# EAGLE design Connector (EAGLE 7.1.0)
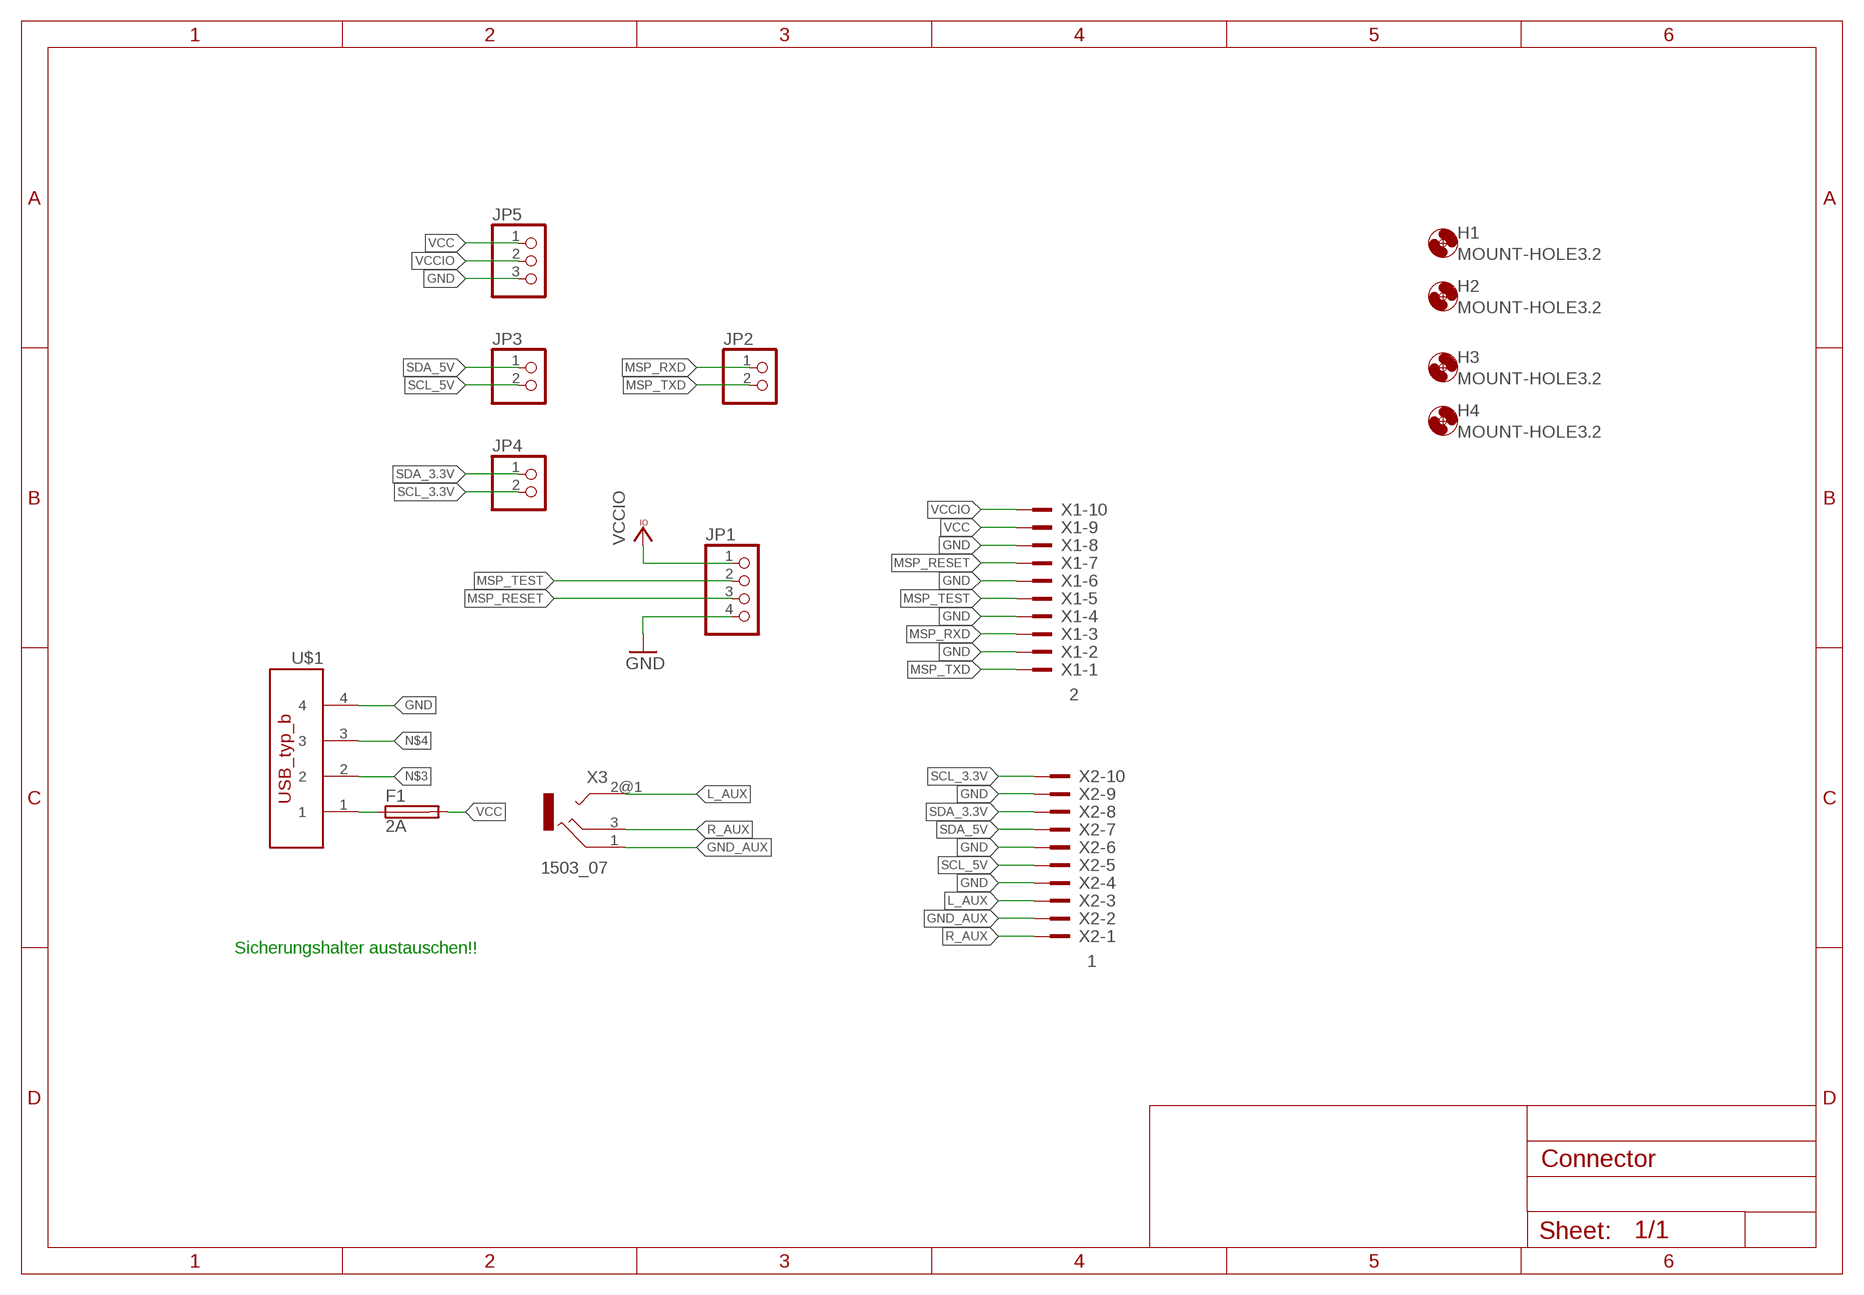
[diagram p0: schematic, sheet 1]

## Parts
F1  2A  SH22,5A  [SH22,5A]
H1  MOUNT-HOLE3.2  [3,2]
H2  MOUNT-HOLE3.2  [3,2]
H3  MOUNT-HOLE3.2  [3,2]
H4  MOUNT-HOLE3.2  [3,2]
JP1  PINHD-1X4  [1X04]
JP2  PINHD-1X2  [1X02]
JP3  PINHD-1X2  [1X02]
JP4  PINHD-1X2  [1X02]
JP5  PINHD-1X3  [1X03]
U$1  USB_TYP_B  [USB_TYP_B]
X1  2  2510-  [PAK100/2500-10]
X2  1  2510-  [PAK100/2500-10]
X3  1503_07  [1503_07]

## Nets
GND: JP1.4 JP5.3 U$1.4 X1.2 X1.4 X1.6 X1.8 X2.4 X2.6 X2.9
GND_AUX: X2.2 X3.1
L_AUX: X2.3 X3.2@1
MSP_RESET: JP1.3 X1.7
MSP_RXD: JP2.1 X1.3
MSP_TEST: JP1.2 X1.5
MSP_TXD: JP2.2 X1.1
N$1: F1.1 U$1.1
N$3: U$1.2
N$4: U$1.3
R_AUX: X2.1 X3.3
SCL_3.3V: JP4.2 X2.10
SCL_5V: JP3.2 X2.5
SDA_3.3V: JP4.1 X2.8
SDA_5V: JP3.1 X2.7
VCC: F1.2 JP5.1 X1.9
VCCIO: JP1.1 JP5.2 X1.10
Unconnected: X3.2@2

## Notes on the sheet
- Sicherungshalter austauschen!!

## Library data of the parts
F1 = fuse:SH22,5A: FUSE HOLDER grid 22,5mm, isolated cap OGN0031 8201, Schurter (Buerklin); MPN: 0031.7701.11; OC_FARNELL: unknown; OC_NEWARK: 04F1224
H1-H4 = holes:MOUNT-HOLE: MOUNTING HOLE with drill center marker
JP1 = pinhead:PINHD-1X4: PIN HEADER
JP2-JP4 = pinhead:PINHD-1X2: PIN HEADER
JP5 = pinhead:PINHD-1X3: PIN HEADER
U$1 = USB_typ_b:USB_TYP_B
X1 X2 = con-3m:2510-: 3M (TM) Pak 100 4-Wall Header Source: 3M; MF: 3M; MPN: 2510-6002UB; OC_FARNELL: 9838244; OC_NEWARK: 46F4725
X3 = con-lumberg:1503_?: Jack connectors according to JISC 6560, 3.5 mm Klinkensteckverbinder nach JISC 6560, 3,5 mm Source: http://www.lumberg.com/Produkte/PDFs/1503_08.pdf; OC_FARNELL: unknown; OC_NEWARK: unknown

## Board
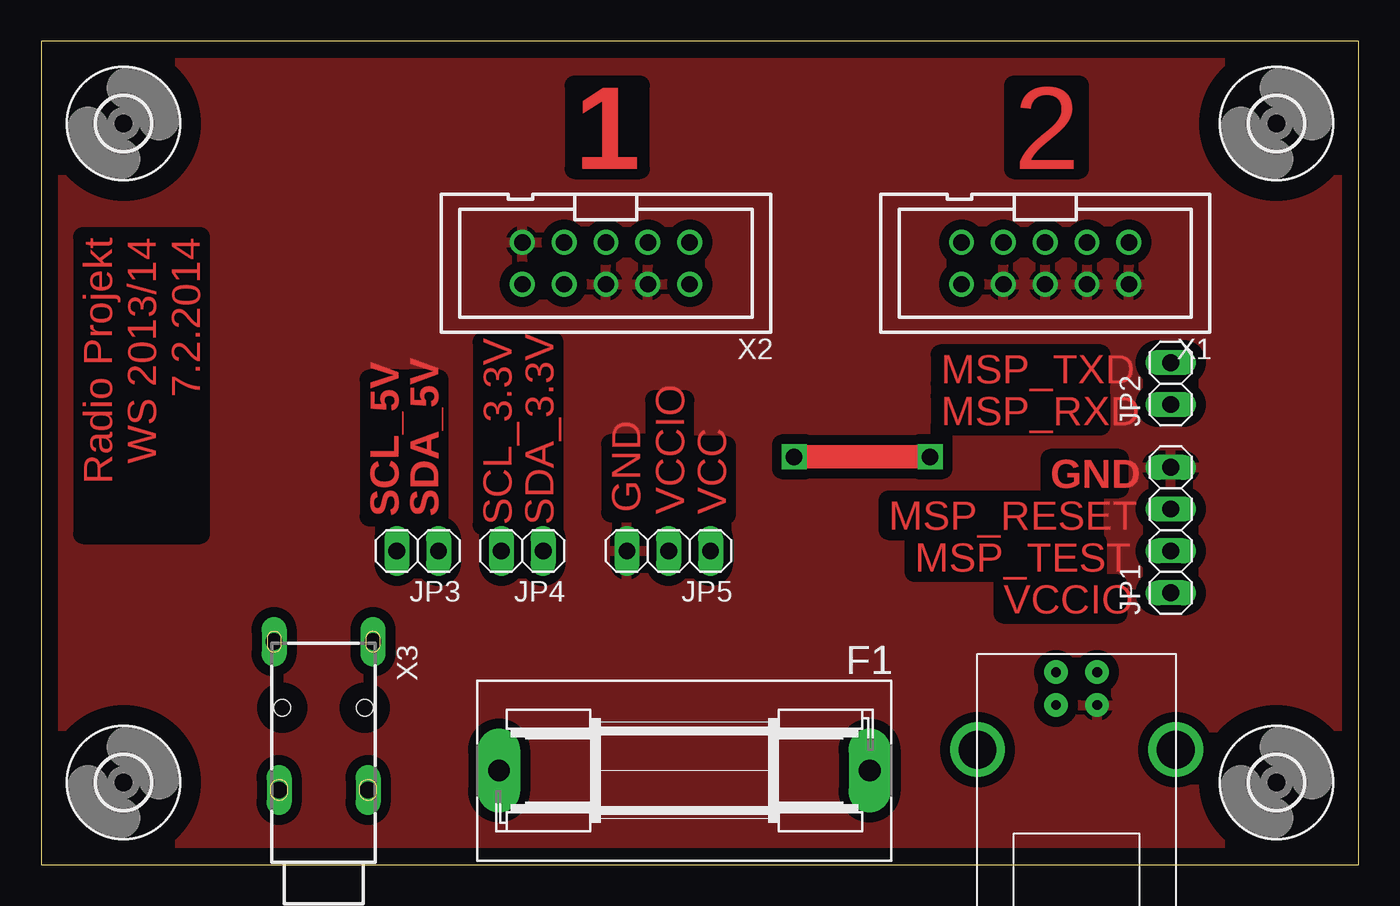
[diagram p1: board, top side]
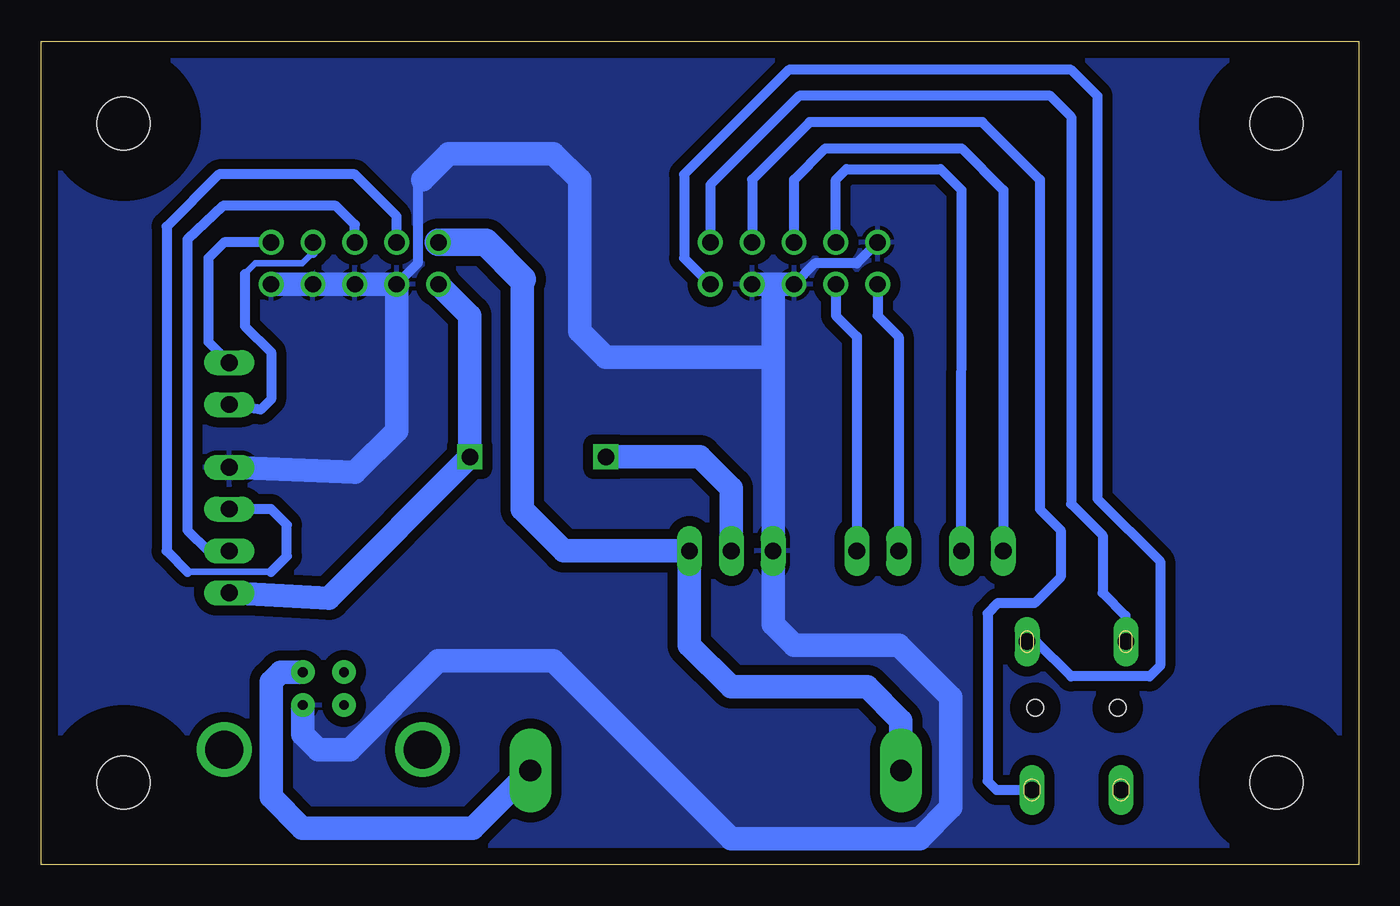
[diagram p2: board, bottom side, seen from below]

Size 80 x 50 mm. Coordinates in mm from the lower left corner, seen from the top.
Outline: 0,0 80,0 80,50 0,50 0,0
Copper layers (1*16): Top 0.035mm / dielectric 1.5mm / Bottom 0.035mm
Design rules "default": minimum track width 10mil, minimum drill 24mil, track to track 8mil, track to pad 8mil, pad to pad 8mil, via to via 8mil, smd to smd 8mil, copper to edge 40mil, drill to drill 8mil, minimum pad ring 10mil, minimum via ring 8mil, stop-mask expansion 4mil, vias tented up to drill 0mil, thermal gap 10mil

### Footprints (pad centres in the part's own frame; a part is rotated, then mirrored left to right if it is on the bottom)
SH22,5A = drill 1.321 pad 2.54 long: 1 -11.252,0; 2 11.252,0
3,2 = hole 3.2: 0,0
1X04 = drill 1.016 long: 1 -3.81,0; 2 -1.27,0; 3 1.27,0; 4 3.81,0
1X02 = drill 1.016 long: 1 -1.27,0; 2 1.27,0
1X03 = drill 1.016 long: 1 -2.54,0; 2 0,0; 3 2.54,0
USB_TYP_B = drill 0.6 pad 1.422: 1 4.71,-1.25; 2 4.71,1.25; 3 2.71,1.25; 4 2.71,-1.25 | drill 2.3: P$1 0,6.02; P$2 0,-6.02
PAK100/2500-10 = drill 1 pad 1.422: 1 -5.08,-1.27; 2 -5.08,1.27; 3 -2.54,-1.27; 4 -2.54,1.27; 5 0,-1.27; 6 0,1.27; 7 2.54,-1.27; 8 2.54,1.27; 9 5.08,-1.27; 10 5.08,1.27
1503_07 = drill 1 pad 1.2 long: 1 -3,-11; 2@1 -2.7,-2; 2@2 2.7,-2; 3 3,-11 | hole 1: -2.5,-7; 2.5,-7

### Placement (x,y rotation side)
F1  39.05,5.71 180 top
H1  5,5 0 top
H2  75,5 0 top
H3  5,45 0 top
H4  75,45 0 top
JP1  68.58,20.32 90 top
JP2  68.58,29.21 90 top
JP3  22.86,19.05 180 top
JP4  29.21,19.05 180 top
JP5  38.1,19.05 180 top
U$1  62.87,6.99 90 top
X1  60.96,36.51 180 top
X2  34.29,36.51 180 top
X3  17.14,2.54 180 top

### Tracks (layer width: path | path; a pad name or v marks a point on that pad's centre or on a via)
GND
  Bottom 0.61: X2.9 30.48,36.51 33.02,36.51 X2.6 | 56.83,41.59 57.15,41.27 57.15,36.51 X1.8
  Bottom 1.422: 35.56,30.8 JP5.3 35.56,14.61 34.29,13.34 27.94,13.34 24.77,10.16 24.77,3.49 26.67,1.59 38.1,1.59 48.9,12.38 55.88,12.38 61.28,6.99 63.18,6.99 64.11,7.92 U$1.4 | 35.56,30.8 35.56,35.24 | X2.4 35.56,35.24 | 35.56,35.24 X2.6 | X1.2 X1.4 X1.6 X1.8 58.42,26.35 60.96,23.81 JP1.4 | 35.56,30.8 45.72,30.8 47.31,32.38 47.31,41.59 48.9,43.18 55.24,43.18 56.83,41.59
  pour Top (isolate 0.61): -2.54,0.64 80.01,0 80.01,49.85 -2.54,50.48
  pour Bottom (isolate 0.61): -1.27,0.64 80.01,0 80.01,49.85 -1.27,50.48
GND_AUX
  Bottom 0.61: X2.2 40.96,36.83 40.96,41.91 34.61,48.26 17.46,48.26 15.88,46.67 15.88,22.23 12.06,18.41 12.06,12.06 12.7,11.43 17.46,11.43 19.57,13.54 X3.1
L_AUX
  Bottom 0.61: X2.3 36.83,41.59 33.34,45.09 22.86,45.09 19.37,41.59 19.37,21.59 18.1,20.32 18.1,17.46 19.68,15.88 21.91,15.88 22.54,15.24 22.54,5.08 22,4.54 X3.2@1
MSP_RESET
  Bottom 0.406: 71.12,17.78 66.04,17.78
  Bottom 0.61: X1.7 58.42,39.37 60.96,41.91 69.22,41.91 72.39,38.73 72.39,19.05 71.12,17.78 | 66.04,17.78 65.09,18.73 65.09,20.64 66.04,21.59 JP1.3
MSP_RXD
  Bottom 0.406: 63.5,37.15 64.14,36.51 66.99,36.51 67.63,35.88
  Bottom 0.61: X1.3 63.5,37.15 | 67.63,35.88 67.63,32.7 66.04,31.11 66.04,28.26 66.67,27.62 JP2.1
MSP_TEST
  Bottom 0.61: X1.5 60.96,38.86 62.1,40.01 68.96,40.01 71.12,37.97 71.12,20.32 69.85,19.05 JP1.2
MSP_TXD
  Bottom 0.61: X1.1 68.9,37.78 69.85,36.83 69.85,31.75 JP2.2
N$1
  Bottom 1.422: F1.1 53.8,2.22 64.14,2.22 66.04,4.13 66.04,11.11 65.46,11.7 U$1.1
R_AUX
  Bottom 0.61: X2.1 39.37,41.27 33.97,46.67 18.73,46.67 17.46,45.4 17.46,21.91 15.56,20 15.56,16.51 14.18,15.13 X3.3
SCL_3.3V
  Bottom 0.61: X2.10 29.21,33.34 27.94,32.07 JP4.2
SCL_5V
  Bottom 0.61: X2.5 34.29,41.59 32.38,43.5 24.12,43.5 21.58,40.96 JP3.2
SDA_3.3V
  Bottom 0.61: X2.8 31.75,33.34 30.48,32.07 JP4.1
SDA_5V
  Bottom 0.61: X2.7 31.75,41.59 31.11,42.23 25.39,42.23 24.12,40.96 JP3.1
VCC
  Bottom 1.422: F1.2 27.8,8.75 29.84,10.79 38.1,10.79 40.64,13.34 JP5.1 48.26,19.05 50.8,21.59 50.8,35.56
  Bottom 1.676: X1.9 53.02,37.78 50.8,35.56
VCCIO  (via drill 1)
  Top 1.422: v45.72,24.77 v53.98,24.77
  Bottom 1.422: JP5.2 38.1,22.86 40.01,24.77 v45.72,24.77 | X1.10 53.98,33.34 v53.98,24.77 62.55,16.19 JP1.1

### Text on the board
Top: 1 | 2 | Radio Projekt / WS 2013/14 / 7.2.2014 | MSP_TXD | MSP_RXD | GND | SCL_5V | SDA_5V | SCL_3.3V | SDA_3.3V | GND | VCCIO | VCC | MSP_RESET | MSP_TEST | VCCIO